# EAGLE design GB2 USB-C Charging Kit (EAGLE 6.2)
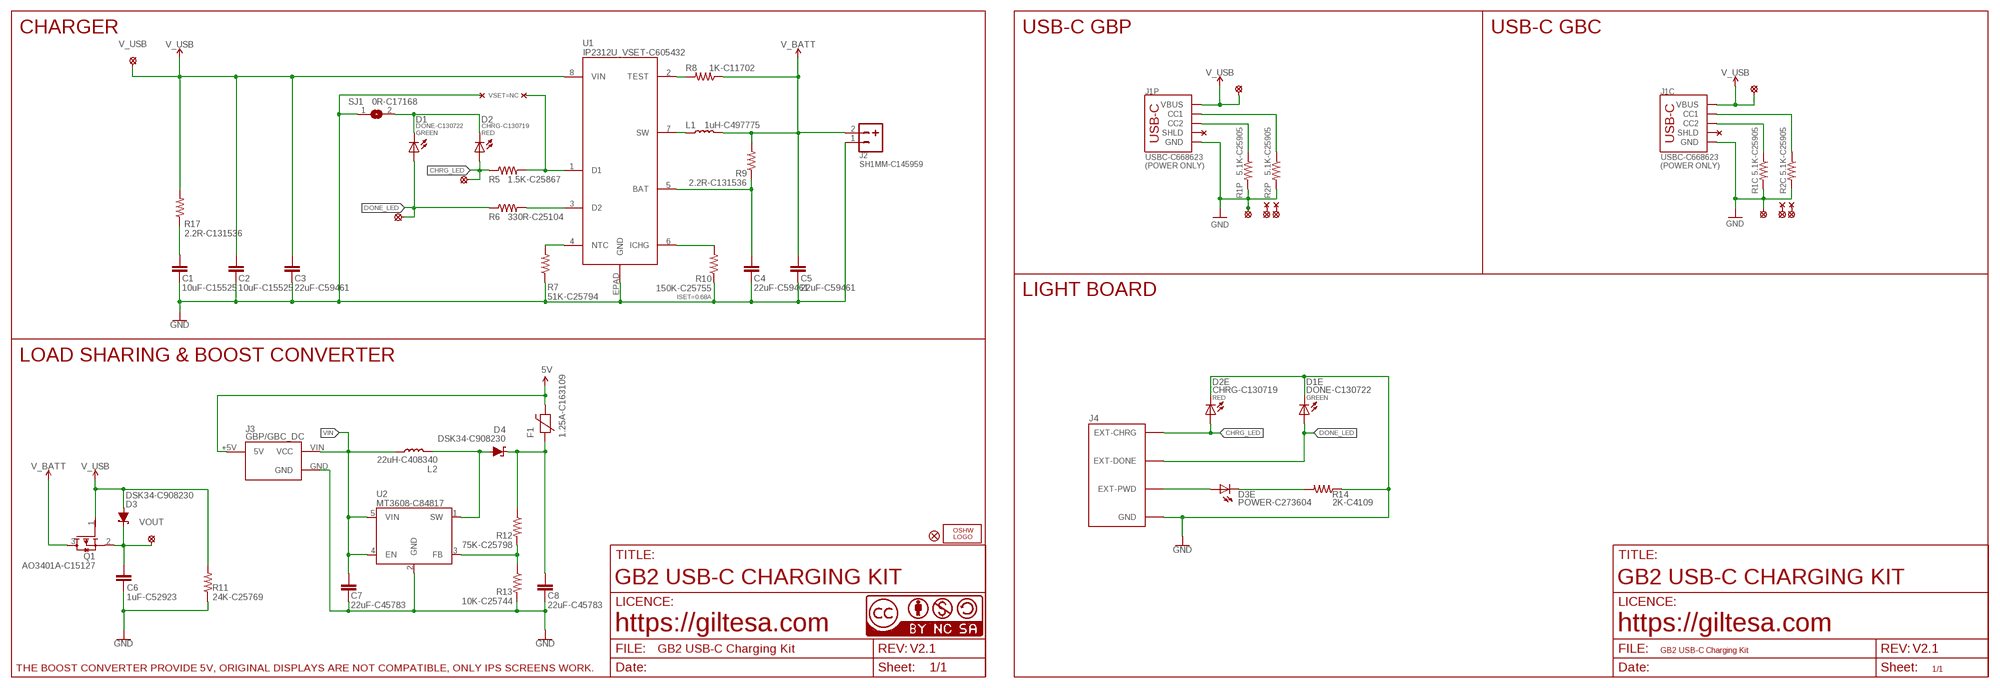
[diagram p0: schematic, sheet 1]

## Parts
C1  10uF-C15525  C0402_S  [C0402_S]
C2  10uF-C15525  C0402_S  [C0402_S]
C3  22uF-C59461  C0603_SMALL  [C0603_S]
C4  22uF-C59461  C0603_SMALL  [C0603_S]
C5  22uF-C59461  C0603_SMALL  [C0603_S]
C6  1uF-C52923  C0402_S  [C0402_S]
C7  22uF-C45783  C0805_SMALL  [C0805_S]
C8  22uF-C45783  C0805_SMALL  [C0805_S]
D1  DONE-C130722  LED_0402  [L0402]
D1E  DONE-C130722  LED_0402  [L0402]
D2  CHRG-C130719  LED_0402  [L0402]
D2E  CHRG-C130719  LED_0402  [L0402]
D3  DSK34-C908230  DIODE-SCHOTTKY_SOD-123FL  [SOD-123FL]
D3E  POWER-C273604  LED_0402  [L0402]
D4  DSK34-C908230  DIODE-SCHOTTKY_SOD-123FL  [SOD-123FL]
F1  1.25A-C163109  FUSE0603_S  [F0603_S]
FD1  FIDUCIALUFIDUCIAL  [FIDUCIAL-MICRO]
FD2  FIDUCIALUFIDUCIAL  [FIDUCIAL-MICRO]
FD3  FIDUCIALUFIDUCIAL  [FIDUCIAL-MICRO]
J1C  USBC-C668623  USB-C_6P_POWER  [USB-C_6P]
J1P  USBC-C668623  USB-C_6P_POWER  [USB-C_6P]
J2  SH1MM-C145959  JST-21MM_TOP  [JST-2-1MM-SMD_TOP]
J3  GBP/GBC_DC  GBC_DC_DCGB2  [GB2_DC-DC]
J4  GB2_LED  [GB2_LED]
L1  1uH-C497775  INDUCTOR_2  [PSPMAA0402]
L2  22uH-C408340  INDUCTOR_2  [PSPMAA0402]
LOGO1  OSHW_LOGO_FILLX0150-NT  [OSHW_FILLX150_NOTEXT]
Q1  AO3401A-C15127  AO3401A_SMALL  [SOT23-3_S]
R1C  5.1K-C25905  R0402  [R0402]
R1P  5.1K-C25905  R0402  [R0402]
R2C  5.1K-C25905  R0402  [R0402]
R2P  5.1K-C25905  R0402  [R0402]
R5  1.5K-C25867  R0402  [R0402]
R6  330R-C25104  R0402  [R0402]
R7  51K-C25794  R0402  [R0402]
R8  1K-C11702  R0402  [R0402]
R9  2.2R-C131536  R0402  [R0402]
R10  150K-C25755  R0402  [R0402]
R11  24K-C25769  R0402  [R0402]
R12  75K-C25798  R0402  [R0402]
R13  10K-C25744  R0402  [R0402]
R14  2K-C4109  R0402  [R0402]
R17  2.2R-C131536  R0402  [R0402]
SJ1  0R-C17168  JUMPER-SMD0402  [JUMPER-SMD_0402]
U1  IP2312U_VSET-C605432  IP2312_CUSTOM  [IP2312]
U2  MT3608-C84817  MT3608"  [SOT-23-6]
U$2  PAD_1.1  [PAD_1.1]
U$11  PAD_1.1  [PAD_1.1]
U$13  CC-NC-BCNIX  [CC-NC-B_NIX]
U$15  PAD_1.1  [PAD_1.1]
U$19  PAD_1.1  [PAD_1.1]
U$20  SOLDER_PAD-1.7  [SOLDER_PAD_1.7]
U$21  SOLDER_PAD-1.7  [SOLDER_PAD_1.7]
U$23  VOUT  PAD_0.8  [PAD_0.8]
U$24  V_USB  PAD_0.8  [PAD_0.8]
U$25  PAD_1.1  [PAD_1.1]
U$26  SOLDER_PAD-2.0  [SOLDER_PAD_2.0]
U$27  SOLDER_PAD-2.0  [SOLDER_PAD_2.0]
U$32  SOLDER_PAD-2.5  [SOLDER_PAD_2.5]
U$33  PAD_1.1  [PAD_1.1]

## Nets
5V: F1.2 J3.+5V(5V)
CHRG_LED: D2.A D2E.A J4.EXT-CHRG R5.1 U$21.P$1
DONE_LED: D1.A D1E.A J4.EXT-DONE R6.1 U$20.P$1
GND: C1.1 C2.1 C3.1 C4.1 C5.1 C6.2 C7.1 C8.1 D1E.C D2E.C J1C.A12-GND(GND) J1C.B12-GND(GND) J1P.A12-GND(GND) J1P.B12-GND(GND) J2.1 J3.GND J4.GND1(GND) J4.GND2(GND) J4.GND3(GND) J4.GND4(GND) J4.GND5(GND) R1C.2 R1P.2 R2C.2 R2P.2 R7.1 R10.1 R11.1 R13.2 R14.1 SJ1.1 U1.EPAD(GND) U2.2(GND) U$19.P$1 U$26.P$1 U$27.P$1
N$4: J1C.B5(CC2) R1C.1
N$5: J1P.A5(CC1) R2P.1
N$6: J1P.B5(CC2) R1P.1
N$8: D4.A L2.P$2 U2.1(SW)
N$9: D1.C D2.C SJ1.2
N$10: D3E.A J4.EXT-PWD J4.EXT-PWD'(EXT-PWD)
N$11: D3E.C R14.2
N$12: R12.2 R13.1 U2.3(FB)
N$13: J1C.A5(CC1) R2C.1
N$14: C8.2 D4.C F1.1 R12.1
N$15: C4.2 R9.1 U1.5(BAT)
N$16: R8.2 U1.2(TEST)
N$17: C1.2 R17.1
N$19: R5.2 U1.1(D1)
N$27: R7.2 U1.4(NTC)
N$28: R10.2 U1.6(ICHG)
N$29: R6.2 U1.3(D2)
N$31: L1.P$1 U1.7(SW)
V_BATT: C5.2 J2.2 L1.P$2 Q1.3(D) R8.1 R9.2
V_USB: C2.2 C3.2 D3.A J1C.A9-VBUS(VBUS) J1C.B9-VBUS(VBUS) J1P.A9-VBUS(VBUS) J1P.B9-VBUS(VBUS) Q1.1(G) R11.2 R17.2 U1.8(VIN) U$24.P$1 U$25.P$1 U$33.P$1
VCC: C6.1 D3.C Q1.2(S) U$23.P$1
VIN: C7.2 J3.VIN(VCC) L2.P$1 U2.4(EN) U2.5(VIN)
Unconnected: J1C.SHLD1(SHLD) J1C.SHLD2(SHLD) J1C.SHLD3(SHLD) J1C.SHLD4(SHLD) J1P.SHLD1(SHLD) J1P.SHLD2(SHLD) J1P.SHLD3(SHLD) J1P.SHLD4(SHLD) U$2.P$1 U$11.P$1 U$15.P$1 U$32.P$1

## Notes on the sheet
- CHARGER | USB-C GBP | USB-C GBC
- VSET=NC
- GREEN | RED
- (POWER ONLY) | (POWER ONLY)
- LIGHT BOARD
- ISET=0.68A
- LOAD SHARING & BOOST CONVERTER
- RED | GREEN
- GB2 USB-C CHARGING KIT | GB2 USB-C CHARGING KIT
- https://giltesa.com | https://giltesa.com
- V2.1 | V2.1
- THE BOOST CONVERTER PROVIDE 5V, ORIGINAL DISPLAYS ARE NOT COMPATIBLE, ONLY IPS SCREENS WORK.

## Library data of the parts
C1 C2 C6 = ,giltesa:C0402
C3-C5 = ,giltesa:C0603
C7 C8 = ,giltesa:C0805
D1 D1E D2 D2E D3E = ,giltesa:LED
D3 D4 = ,giltesa:DIODE-SCHOTTKY
F1 = ,giltesa:FUSE
FD1-FD3 = SparkFun-Aesthetics:FIDUCIAL: Fiducial Alignment Points Point-of-reference for pick-and-place machines and other optical instruments.
J1C J1P = ,giltesa:USB-C_6P
J2 = ,giltesa:JST-2
J3 = ,giltesa:GBC_DC_DC
J4 = ,giltesa:GB2_LED
L1 L2 = ,giltesa:INDUCTOR
LOGO1 = ohw-logo:OSHW_LOGO_FILL
Q1 = ,giltesa:AO3401A
R1C R1P R2C R2P R5-R14 R17 = ,giltesa:R0402
SJ1 = ,giltesa:JUMPER-SMD
U1 = ,giltesa:IP2312
U2 = ,giltesa:MT3608
U$2 U$11 U$15 U$19 U$23-U$25 U$33 = ,giltesa:PAD
U$13 = cc-by-nc-sa:CC-NC-BC: All hardware is licensed under the Creative Commons Attribution-Noncommercial-Share Alike 2.5 Switzerland License. To view a copy of this license, visit http://creativecommons.org/licenses/by-nc-sa/2.5/ch/ or send a letter to Creative Commons, 171 Second Street, Suite 300, San Francisco, California, 94105, USA.
U$20 U$21 U$26 U$27 U$32 = ,giltesa:SOLDER_PAD

## Net classes
1 power: width 0.61 mm, drill 0.406 mm, clearance 0.203 mm
2 gnd: width 0.305 mm, drill 0.406 mm, clearance 0.203 mm
3 power usb: width 0.508 mm, drill 0.406 mm, clearance 0.203 mm

## Board
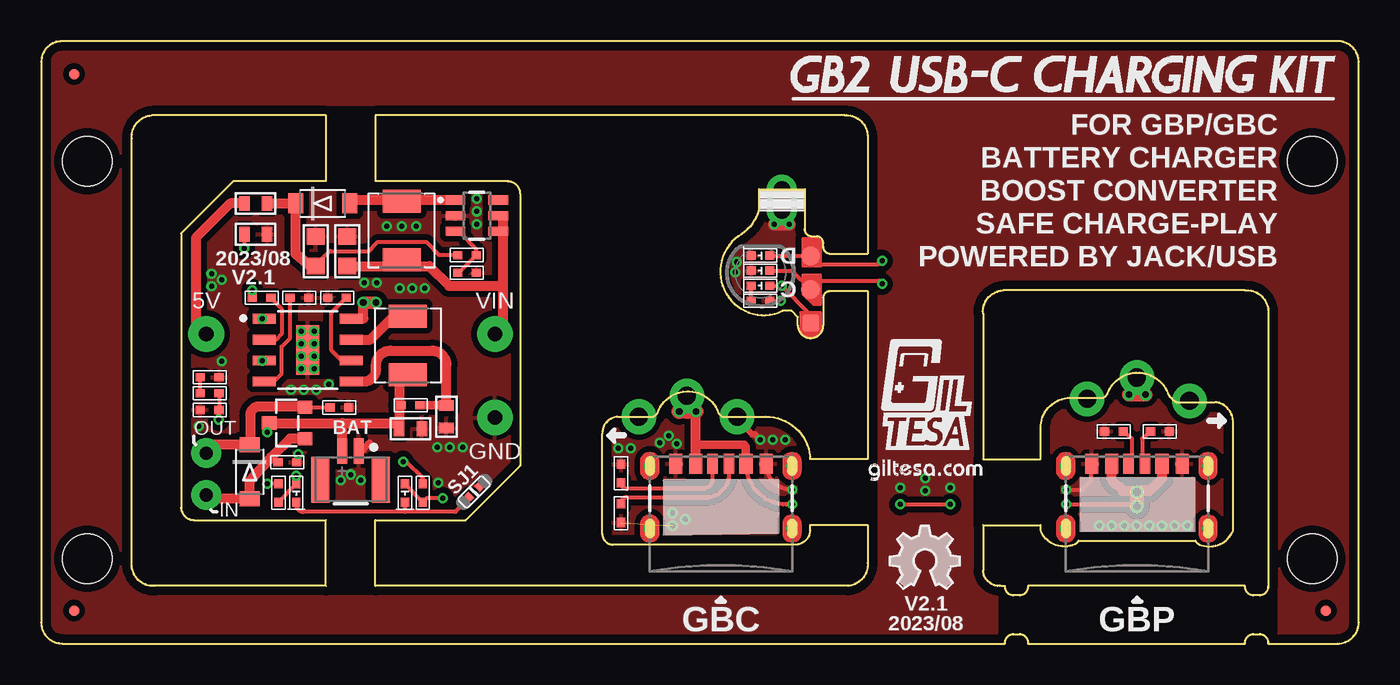
[diagram p1: board, top side]
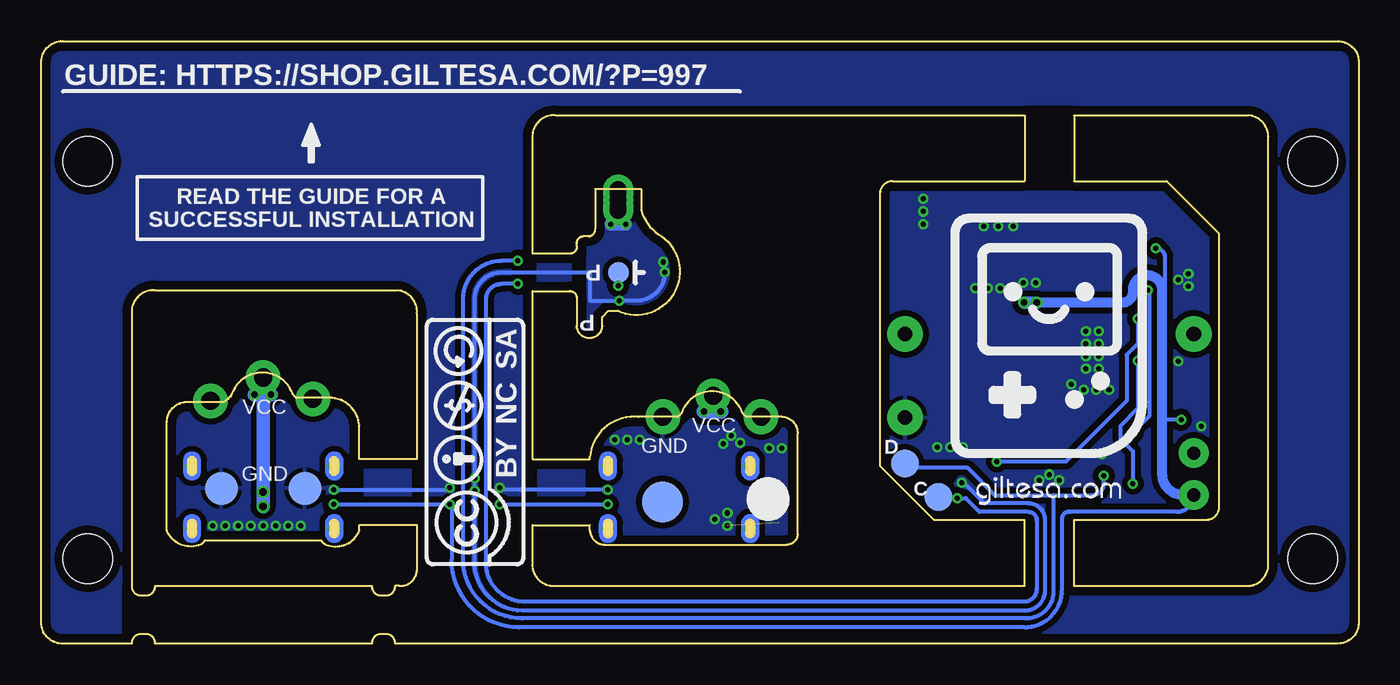
[diagram p2: board, bottom side, seen from below]

Size 80 x 36.57 mm. Coordinates in mm from the lower left corner, seen from the top.
Outline: 46.68,6.89 arc-90 45.78,6.01 34.71,6.01 arc-90 34.07,6.64 34.07,12.75 arc-90 35.01,13.77 37.17,13.77 arc30 37.43,14.02 arc-140 41.11,14.02 arc30 41.36,13.77 43.73,13.77 arc-90 46.68,11.34 46.68,11.2 50.18,11.2 50.18,21.39 47.93,21.39 arc90 47.48,21.02 47.48,19.31 arc-180 45.95,19.31 45.95,19.82 45.56,20.2 45.01,20.2 arc-170 42.33,24.73 arc45 43.57,26.32 43.57,27.59 46.37,27.59 46.37,25.18 arc90 46.75,24.73 47.1,24.73 arc-90 47.48,24.29 47.48,24.13 arc90 47.85,23.68 50.18,23.68 50.18,30.87 arc90 48.79,32.07 20.29,32.07 20.29,28.07 28.31,28.07 arc-90 29.07,27.31 29.07,10.8 25.77,7.5 20.29,7.5 20.29,3.5 48.98,3.5 arc90 50.18,4.9 50.18,7.2 46.68,7.2 46.68,6.89
Outline: 8.5,24.9 8.5,8.26 arc90 9.27,7.5 17.29,7.5 17.29,3.5 6.9,3.5 arc-90 5.5,4.71 5.5,30.68 arc-90 6.71,32.07 17.29,32.07 17.29,28.07 11.68,28.07 8.5,24.9
Outline: 70.32,6.01 arc90 72.37,6.85 72.37,13.49 arc80 71.29,14.66 68.92,14.66 arc-30 68.42,15.17 arc140 64.73,15.17 arc-30 64.48,14.91 62.32,14.91 arc80 60.68,13.24 60.68,11.2 57.18,11.2 57.18,20.05 arc-90 58.39,21.45 73.1,21.45 arc-90 74.5,20.24 74.5,3.5 arc-90 73.98,2.92 73.6,2.92 arc-90 73.09,3.5 59.91,3.5 arc-90 59.41,2.92 59.02,2.92 arc-90 58.52,3.5 58.26,3.5 arc-90 57.18,4.42 57.18,7.2 60.68,7.2 60.68,6.85 arc90 62.73,6.01 arc40 62.98,6.25 70.07,6.25 arc40 70.32,6.01
Outline: 78.7,0 arc90 80,1.27 80,35.31 arc90 78.7,36.57 1.27,36.57 arc90 0,35.31 0,1.27 arc90 1.27,0 58.52,0 arc-90 59.02,0.58 59.41,0.58 arc-90 59.91,0 73.09,0 arc-90 73.6,0.58 73.98,0.58 arc-90 74.5,0 78.7,0
Copper layers (1*16): Top 0.035mm / dielectric 1.6mm / Bottom 0.035mm
Design rules: minimum track width 6mil, minimum drill 12mil, track to track 6mil, track to pad 6mil, pad to pad 6mil, via to via 8mil, smd to smd 0mil, copper to edge 20mil, drill to drill 10mil, minimum pad ring 6mil, minimum via ring 6mil, stop-mask expansion 0mil, vias tented up to drill 100mil, thermal gap 10mil
Holes 3 mm at 77.17,29.29 2.8,29.29 2.8,5.16 77.17,5.16
tRestrict: 20 lines
bRestrict: 20 lines

### Footprints (pad centres in the part's own frame; a part is rotated, then mirrored left to right if it is on the bottom)
C0402_S = smd 0.559 x 0.5: 1 -0.567,0; 2 0.567,0
C0603_S = smd 0.635 x 0.9: 1 -0.694,0; 2 0.694,0
C0805_S = smd 1 x 1.1: 1 -0.901,0; 2 0.901,0
L0402 = smd 0.559 x 0.5: A 0.567,0; C -0.567,0
SOD-123FL = smd 0.91 x 1.22: A 1.637,0; C -1.637,0
F0603_S = smd 0.635 x 0.9: 1 -0.694,0; 2 0.694,0
FIDUCIAL-MICRO = smd 0.635 x 0.635: 1 0,0
USB-C_6P = smd 0.635 x 1.2: A5 -0.5,2.034; B5 0.5,2.034 | smd 0.8 x 1.2: A9-VBUS 1.52,2.034; A12-GND 2.75,2.034; B9-VBUS -1.52,2.034; B12-GND -2.75,2.034 | drill 0.4 pad 0.6: SHLD1 -4.318,1.9; SHLD2 4.32,1.9; SHLD3 -4.318,-1.9; SHLD4 4.32,-1.9
JST-2-1MM-SMD_TOP = smd 0.6 x 1.524: 1 -0.5,-1.869; 2 0.5,-1.869 | smd 1.143 x 2.794: NC1 -1.841,-0.127; NC2 1.841,-0.127
GB2_DC-DC = drill 0.889 pad 2.159: +5V 1.524,11.303; GND 19.05,6.223; VIN 19.05,11.303
GB2_LED = smd 1.143 x 1.143: EXT-CHRG -3.048,1.016; EXT-DONE -3.048,-1.016 | smd 1.27 x 1.27 bottom: EXT-PWD -1.27,0 | smd 1.016 x 1.016: EXT-PWD' -3.048,3.048 | drill 1 pad 1.8: GND1 -1.293,-3.778; GND2 -1.293,-4.032; GND3 -1.293,-4.413; GND4 -1.293,-4.794; GND5 -1.293,-5.048
PSPMAA0402 = smd 1.4 x 2.3: P$1 -1.775,0; P$2 1.775,0
SOT23-3_S = smd 0.8 x 0.9: 1 -0.95,-1.076; 2 0.95,-1.076; 3 0,1.1
R0402 = smd 0.559 x 0.5: 1 -0.567,0; 2 0.567,0
JUMPER-SMD_0402 = smd 0.635 x 0.5: 1 -0.559,0; 2 0.559,0
IP2312 = smd 1.4 x 0.6: 1 -2.65,1.905; 2 -2.65,0.635; 3 -2.65,-0.635; 4 -2.65,-1.905; 5 2.65,-1.905; 6 2.65,-0.635; 7 2.65,0.635; 8 2.65,1.905 | smd 1.4 x 3: EPAD 0,0
SOT-23-6 = smd 0.55 x 1.2: 1 -0.95,-1.3; 2 0,-1.3; 3 0.95,-1.3; 4 0.95,1.3; 5 0,1.3; 6 -0.95,1.3
PAD_1.1 = drill 1.1 pad 2.1: P$1 0,0
SOLDER_PAD_1.7 = smd 1.7 x 1.7: P$1 0,0
PAD_0.8 = drill 0.8 pad 1.8: P$1 0,0
SOLDER_PAD_2.0 = smd 2 x 2: P$1 0,0
SOLDER_PAD_2.5 = smd 2.5 x 2.5: P$1 0,0

### Placement (x,y rotation side)
C1  10.23,16.17 180 top
C2  10.23,14.19 0 top
C3  13.03,24.85 180 top
C4  24.6,13.77 90 top
C5  22.42,13.04 180 top
C6  18.11,14.34 0 top
C7  18.58,23.82 270 top
C8  16.68,23.82 270 top
D1  15.48,9.14 90 top
D1E  43.67,23.56 0 top
D2  22.09,9.14 90 top
D2E  43.67,22.64 0 top
D3  12.66,10.42 270 top
D3E  43.67,21.73 0 top
D4  17.09,26.72 0 top
F1  13.03,26.72 180 top
FD1  2,2 0 top
FD2  2,34.57 0 top
FD3  78,2 0 top
J1C  41.27,8.88 0 top
J1P  66.53,8.88 0 top
J2  18.79,9.82 180 top
J3  8.5,7.5 0 top
J4  43.67,22.52 180 top
L1  22.26,18.11 270 top
L2  21.88,25.07 90 top
LOGO1  51.53,3.34 0 top
Q1  14.95,13.39 90 top
R1C  35.21,7.92 270 top
R1P  67.92,12.88 0 top
R2C  35.21,10.33 90 top
R2P  65.13,12.88 180 top
R5  23.17,9.14 90 top
R6  14.41,9.14 90 top
R7  15.68,20.99 180 top
R8  13.39,20.99 0 top
R9  22.42,14.47 180 top
R10  17.96,20.99 0 top
R11  14.95,11.01 180 top
R12  25.85,23.58 0 top
R13  25.85,22.52 0 top
R14  43.67,20.82 180 top
R17  10.23,15.2 0 top
SJ1  26.29,9.21 225 top
U1  16.18,17.82 0 top
U2  26.45,25.98 270 top
U$1  [GILTESA_LOGO_MASK_7MM]  50.38,11.67 0 top
U$2  63.5,14.86 0 top
U$4  [GB2_FRAME]  45.57,33.4 0 top
U$7  CC-BY-NC-SA15MM  [CC-BY-NC-SA_15MM]  50.61,4.68 90 bottom
U$11  36.28,13.77 0 top
U$13  0,0 0 top
U$15  69.72,14.73 0 top
U$19  42.25,13.77 0 top
U$20  27.56,10.92 0 bottom
U$21  25.53,8.89 0 bottom
U$22  [GAME_BOY_2]  24.82,11.25 0 bottom
U$23  10.02,11.56 0 top
U$24  10.02,9.02 0 top
U$25  66.52,16.15 0 top
U$26  63.98,9.42 0 bottom
U$27  69.06,9.42 0 bottom
U$28  [GILTESA.COM_MASK_7MM]  50.21,9.83 0 top
U$29  [GILTESA.COM_MASK_9MM]  23.3,8.38 0 bottom
U$32  42.26,8.59 0 bottom
U$33  39.2,15.04 0 top

### Tracks (layer width: path | path; a pad name or v marks a point on that pad's centre or on a via)
5V
  Top 0.61: F1.2 11.48,26.72 9.4,24.64 9.4,19.43 J3.+5V
CHRG_LED  (via drill 0.3)
  Top 0.254: D2.A R5.1 | D2E.A 45.58,22.64 J4.EXT-CHRG 47.25,22.03 50.86,22.03 arc-90 v51.05,21.83 | v24.38,8.83 23.42,8.83 R5.1 | R5.1
  Bottom 0.254: v51.05,21.83 52.07,21.83 arc-90 52.98,20.92 52.98,5.08 arc-90 50.8,2.54 20.32,2.54 arc-90 19.56,3.3 19.56,7.49 arc-90 20.07,8 23.04,8 23.86,8.83 v24.38,8.83 25.46,8.83 U$21.P$1
DONE_LED  (via drill 0.3)
  Top 0.254: R6.1 D1.A 15.49,9.72 v15.49,10.19 | D1E.A 46.7,23.56 J4.EXT-DONE 47.21,23.05 50.86,23.05 arc90 v51.05,23.24
  Bottom 0.254: 18.54,9.02 18.54,3.17 arc90 20.19,1.52 50.8,1.52 arc90 54.38,5.08 54.38,20.93 arc90 52.07,23.24 v51.05,23.24 | 18.54,9.02 22.1,9.02 23.75,10.67 27.3,10.67 U$20.P$1 | 15.48,10.28 v15.49,10.19 arc90 15.48,10.28 | 18.54,9.02 16.18,9.02 arc-90 D1.A 15.48,10.28
GND  (via drill 0.3)  (1 unrouted)
  Top 0.254: v62.23,9.34 63.18,9.34 63.75,9.91 63.75,10.9 | v45.59,9.34 arc-90 44.02,10.91 J1C.A12-GND | R14.1 v44.9,20.82 | 15.51,11.27 R11.1 v15.6,11.48
  Top 0.406: J2.1 19.54,11.74 19.91,12.19 19.94,12.19 | U$19.P$1 42.25,13.63 43.18,12.7 43.34,12.7 v43.66,12.37
  Top 0.762: v45.42,25.45 v44.5,25.45
  Bottom 0.254: v45.59,9.34 52.03,9.34 arc90 v52.16,9.46 | v62.23,9.34 55.33,9.34 arc-90 v55.21,9.46 | v42.14,22.53 arc90 43.86,20.82 v44.9,20.82 44.91,20.83 46.67,20.83 46.67,22.54 52.07,22.54 arc-90 53.68,20.92 v53.68,10.03 53.68,5.08 arc-94 50.79,2 20.29,2 arc-90 19.04,3.25 19.04,7.48 arc-90 20.07,8.51 22.73,8.51 23.98,9.75 v24.11,9.75
  Bottom 0.762: J4.GND1 44.97,25.45 v45.42,25.45 v44.5,25.45
  other vias: 66.53,7.17 67.29,7.17 68.05,7.17 68.81,7.17 69.57,7.17 65.76,7.17 65,7.17 64.24,7.17 45.19,12.37 38.33,7.93 38.33,7.17 39.09,7.55 35.03,11.86 35.79,11.86 38.1,12.63 38.59,12.12 37.54,12.19 53.68,9.27 42.23,23.17 18.79,10.26 18.18,9.91 19.4,9.91 16.57,18.96 15.8,18.96 15.8,18.2 16.57,18.2 16.57,17.44 16.57,16.68 15.8,16.68 15.8,17.44 15.93,15.42 15.17,15.42 16.69,15.42 17.45,15.74 26.45,25.47 26.45,26.23 26.45,27 21.88,25.34 20.99,25.34 22.77,25.34 10.98,22.09 10.34,22.47 10.34,21.71 23.3,21.58 22.53,21.58 21.77,21.58 19.61,21.9 24.06,11.93 24.82,11.93 25.58,11.93 10.98,17.13 9.58,13.2 20.38,21.9 44.43,12.37
  pour Top (isolate 0.356): -1,37.57 81,37.57 81,-1 -1,-1
  pour Bottom (isolate 0.356): -1,37.57 81,37.57 81,-1 -1,-1
N$4
  Top 0.254: J1C.B5 41.77,10.27 arc-90 40.39,8.89 35.56,8.89 arc90 35.25,8.58
  Top 0.305: R1C.1 35.25,8.58
N$5
  Top 0.254: R2P.1 65.73,12.88 66.22,12.45 66.22,11.01 J1P.A5
N$6
  Top 0.254: R1P.1 67.36,12.88 66.84,12.45 66.84,11.01 J1P.B5
N$8
  Top 0.61: U2.1 21.97,26.93 | 21.97,26.93 19.06,26.93 D4.A | L2.P$2 21.97,26.93
N$9
  Top 0.254: SJ1.2 25.64,8.49 25.15,8 22.09,8 | 22.09,8 15.93,8 arc-90 15.48,8.45 D1.C | D2.C 22.09,8
N$10  (via drill 0.3)
  Top 0.254: D3E.A v44.96,21.73 46.61,20.07 46.61,19.47 J4.EXT-PWD'
  Bottom 0.254: v44.96,21.73 44.94,22.13 J4.EXT-PWD
N$11
  Top 0.254: R14.2 D3E.C
N$12
  Top 0.254: R13.1 25.36,22.52 R12.2 26.42,23.93 25.39,25.01 25.16,25.01 U2.3
N$13
  Top 0.254: J1C.A5 40.77,10.04 arc-90 40.13,9.4 35.57,9.4 arc-90 R2C.1
N$14
  Top 0.254: C8.2 16.68,23.03 17.53,23.82 19.88,23.82 20.45,24.38 23.37,24.38 24.17,23.58 R12.1
  Top 0.61: F1.1 D4.C 15.45,23.66 16.32,22.92 C8.2
N$15
  Top 0.508: C4.2 R9.1
  Top 0.61: U1.5 19.6,15.91 arc90 20.32,16.64 20.32,16.89 arc-90 21.21,17.78 23.75,17.78 arc-90 24.6,16.93 C4.2
N$16
  Top 0.254: U1.2 14.26,18.45 14.61,18.8 14.61,20.32 13.96,20.97 R8.2
N$17
  Top 0.254: R17.1 C1.2
N$19  (via drill 0.3)
  Top 0.254: U1.1 v13.41,19.72 | R5.2 23.17,10.05 22.17,11.05 v21.97,11.05
  Bottom 0.254: v13.41,19.72 13.41,18.21 14.1,17.53 14.1,14.73 17.78,11.05 v21.97,11.05
N$27
  Top 0.254: U1.4 14.14,15.91 14.61,16.38 14.61,18.03 15.11,18.54 R7.2
N$28
  Top 0.254: R10.2 18.52,20.99 17.59,20.07 17.59,17.84 18.25,17.18 U1.6
N$29  (via drill 0.3)
  Top 0.254: U1.3 v13.41,17.18 | R6.2 v13.72,9.71
  Bottom 0.254: v13.72,9.71 13.72,11.68 14.48,12.45 14.48,13.21 13.41,14.28 v13.41,17.18
N$31
  Top 0.61: U1.7 19.98,18.45 21.41,19.88 L1.P$1
V_BATT  (via drill 0.3)
  Top 0.127: R9.2 21.74,14.46 21.73,14.48
  Top 0.254: v12.83,21.46 12.7,21.34 12.7,20.99 R8.1 | Q1.3 13.72,13.26 v13.72,12.83
  Top 0.61: Q1.3 18.29,13.39 | 18.29,13.39 21.73,13.39 C5.2 21.73,14.48 21.73,16.33 L1.P$2 | J2.2 18.29,13.39
  Bottom 0.254: v13.72,12.83 12.7,13.84 12.7,21.34 v12.83,21.46
V_USB  (via drill 0.3, 0.41, 0.46)
  Top 0.127: R11.2 14.38,11.02 14.03,11.37
  Top 0.254: v52.16,8.45 v55.21,8.45 | v62.23,8.45 66.39,8.45 v66.53,8.31 | v45.59,8.45 45.26,8.45 arc-90 J1C.A9-VBUS | R17.2 C2.2 v10.8,13.59 v10.79,13.59 | C3.2 12.33,24.02 v12.32,24
  Top 0.305: 42.8,10.67 42.8,10.91 | 66.45,8.38 v66.53,8.31
  Top 0.508: 39.75,12.19 39.88,12.06 42.67,12.06 42.79,11.95 J1C.A9-VBUS 42.79,10.91 42.8,10.91
  Top 0.61: J1C.B9-VBUS 39.75,12.19 39.75,13.97 39.37,13.97 39.24,14.1 | J1P.A9-VBUS 68.05,10.01 67.31,9.27 66.6,9.27 | 66.6,9.27 65.66,9.27 65,9.93 J1P.B9-VBUS | 66.6,9.27 v66.53,9.2 | U$24.P$1 10.26,8.78 D3.A 12.66,9.87 14.03,11.37 15.11,12.45 Q1.1 | U1.8 19.56,19.72 v19.56,20.7
  Top 0.762: v20.32,20.7 v19.56,20.7
  Top 0.813: v66.53,8.31 v66.53,9.2 | v66.04,15.11 v67.06,15.11 66.52,15.11 U$25.P$1
  Top 0.914: v39.75,14.1 39.24,14.1 v38.73,14.1
  Bottom 0.254: v62.23,8.45 v55.21,8.45 55.08,8.32 55.08,5.08 arc-90 50.99,0.99 20.29,0.99 arc-90 18.02,3.25 18.02,7.62 arc90 17.53,8 11.05,8 arc-90 U$24.P$1 | v52.16,8.45 v45.59,8.45 | v10.79,13.59 11.68,13.59 11.94,13.72 | 11.94,21.46 12.06,21.59 11.76,21.34 11.76,23.44 arc-90 v12.32,24
  Bottom 0.61: U$33.P$1 39.2,14.13 39.24,14.1 | U$24.P$1 10.68,9.02 arc90 11.94,10.29 11.94,13.72 11.94,21.46 arc-180 13.72,21.46 13.72,21.34 arc90 14.35,20.7 v19.56,20.7
  Bottom 0.762: v19.56,20.7 v20.32,20.7
  Bottom 0.813: U$25.P$1 v66.52,8.31 v66.53,8.31 | v67.06,15.11 v66.04,15.11
  Bottom 0.914: v39.75,14.1 39.24,14.1 v38.73,14.1
VCC
  Top 0.254: Q1.2 C6.1
  Top 0.61: U$23.P$1 10.39,12.06 D3.C 12.7,12.1 12.7,13.84 arc-90 13.26,14.4 15.96,14.4 Q1.2
VIN
  Top 0.127: U2.5 28.01,25.84 | U2.4 28,25.03 28.01,25.02
  Top 0.61: 28.01,25.84 28.01,25.02 28.01,21.59 | 28.01,21.59 28.01,19.26 J3.VIN | C7.2 21.97,22.92 | 21.97,22.92 23.56,22.92 24.77,21.72 27.88,21.72 28.01,21.59 | L2.P$1 21.88,23.01 21.97,22.92

### Text on the board
tPlace: FOR GBP/GBC | BATTERY CHARGER | BOOST CONVERTER | SAFE CHARGE-PLAY | POWERED BY JACK/USB | 2023/08 | V2.1 | OUT | BAT | SJ1 | IN | V2.1 | GBC | 2023/08 | GBP
bPlace: GUIDE: HTTPS://SHOP.GILTESA.COM/?P=997 | READ THE GUIDE FOR A | SUCCESSFUL INSTALLATION | VCC | VCC | D | GND | GND | C
Document: OUT | DONE | CHRG | IN